# EAGLE design gps_13 (EAGLE 6.1)
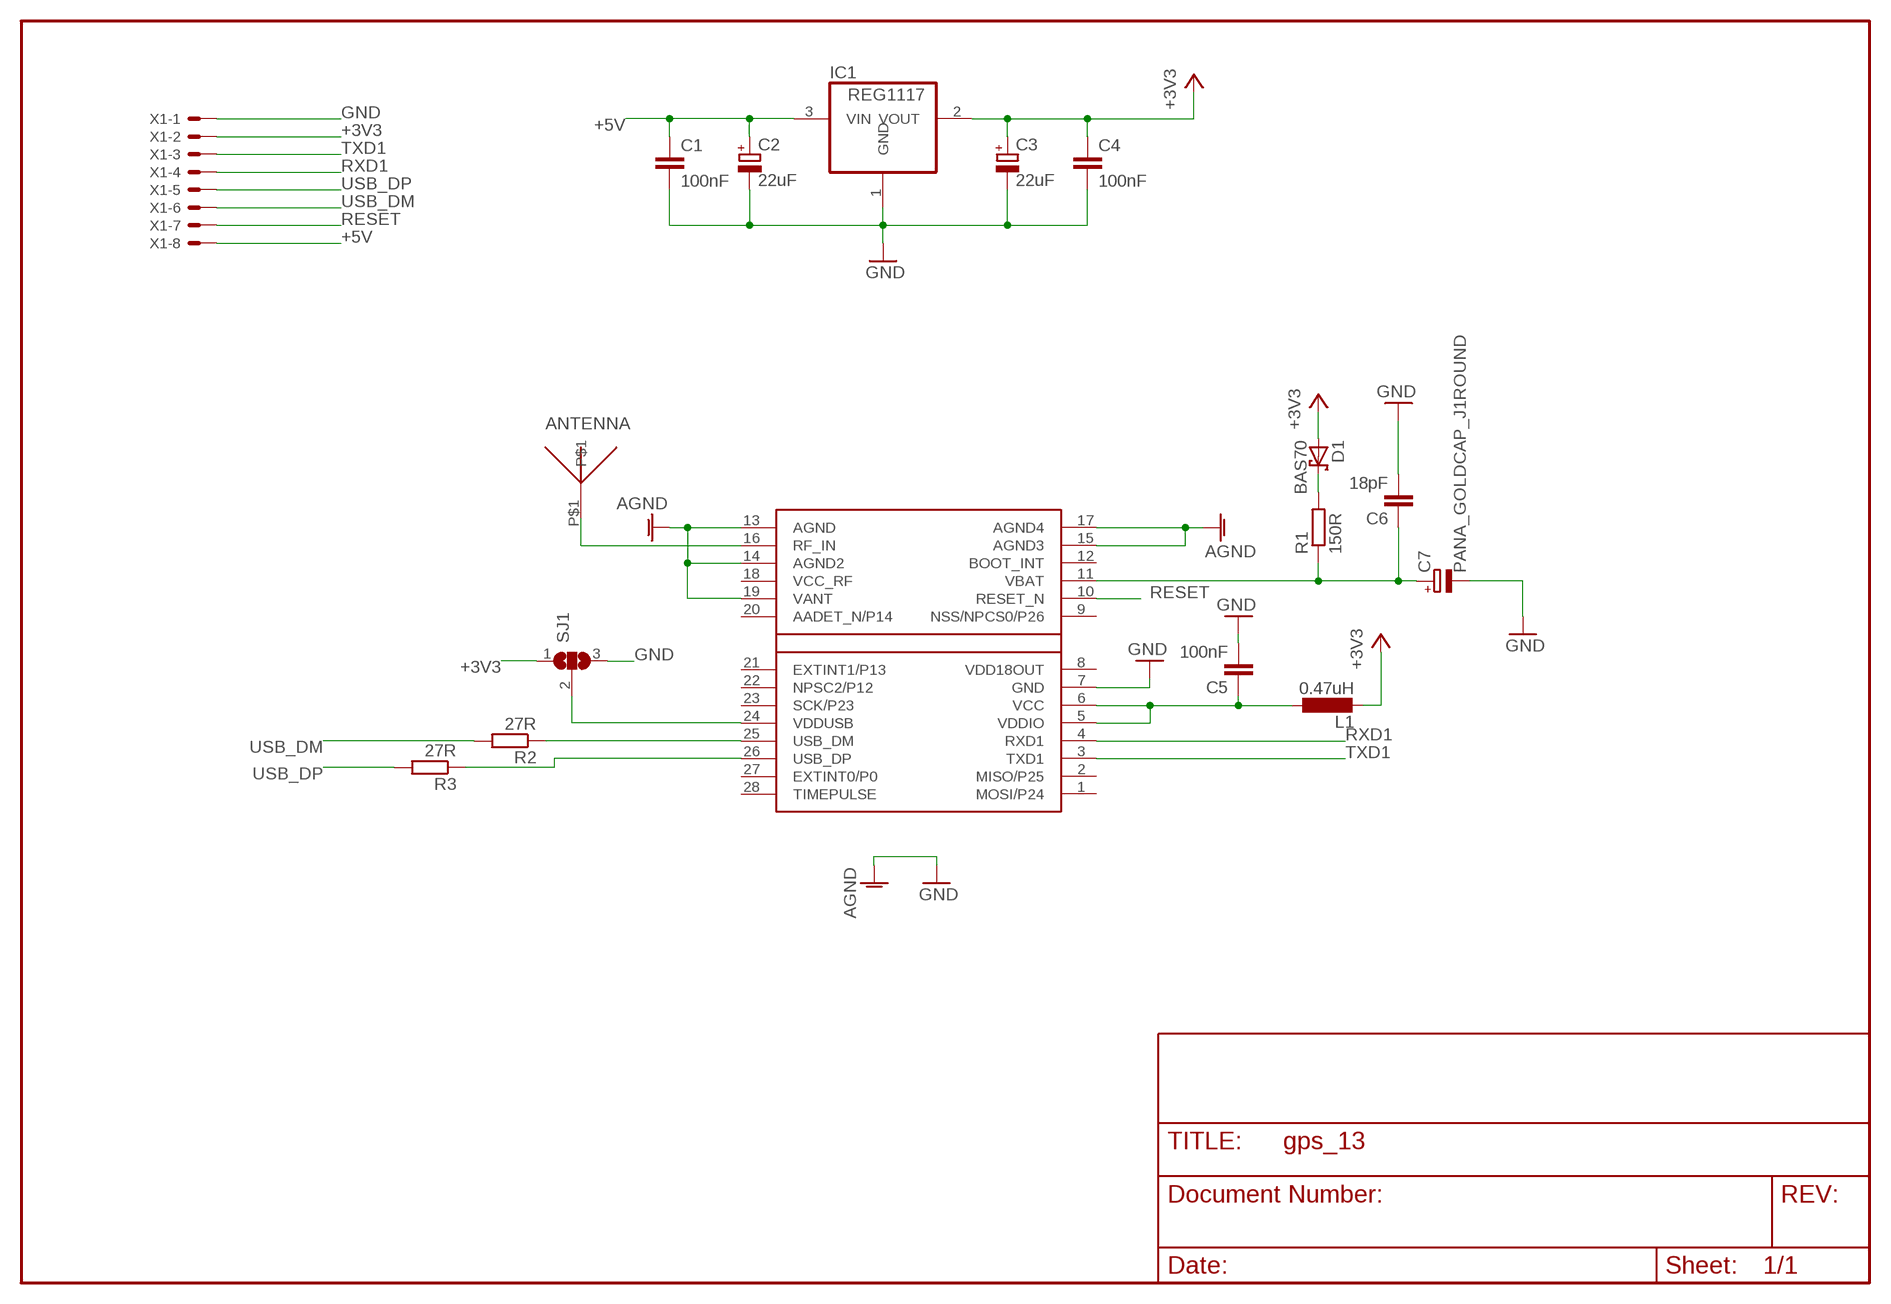
[diagram p0: schematic, sheet 1]

## Parts
ANTENNA  GPS_ANT_13  [GPS_ANT_13]
C1  100nF  C-EUC0603K  [C0603K]
C2  22uF  CPOL-EUB/3528-21R  [B/3528-21R]
C3  22uF  CPOL-EUB/3528-21R  [B/3528-21R]
C4  100nF  C-EUC0603K  [C0603K]
C5  100nF  C-EUC0603K  [C0603K]
C6  18pF  C-EUC0603K  [C0603K]
C7  PANA_GOLDCAP_J1ROUND  [PANA_J1_BIS]
D1  BAS70  [SOT23]
IC1  REG1117  [SOT223]
L1  0.47uH  L-EUL2012C  [L2012C]
R1  150R  R-EU_R1005  [R1005]
R2  27R  R-EU_R1005  [R1005]
R3  27R  R-EU_R1005  [R1005]
SJ1  SJ2W  [SJ_2]
U$6  LEA-4P  [LEA-LA]
X1  53047-08  [53047-08]

## Nets
+3V3: C3.+ C4.1 D1.1(A) IC1.2(VOUT) L1.2 SJ1.1 X1.2
+5V: C1.1 C2.+ IC1.3(VIN) X1.8
GND: C1.2 C2.- C3.- C4.2 C5.2 C6.2 C7.MINUS(-) IC1.1(GND) SJ1.3 U$6.7(GND) U$6.13(AGND) U$6.14(AGND2) U$6.15(AGND3) U$6.17(AGND4) U$6.19(VANT) X1.1 ; supply symbol labelled AGND
N$1: C5.1 L1.1 U$6.5(VDDIO) U$6.6(VCC)
N$3: ANTENNA.P$1 U$6.16(RF_IN)
N$4: R2.1 U$6.25(USB_DM)
N$5: R3.1 U$6.26(USB_DP)
N$8: SJ1.2 U$6.24(VDDUSB)
N$28: C6.1 C7.PLUS(+) R1.1 U$6.11(VBAT)
N$29: D1.3(C) R1.2
RESET: U$6.10(RESET_N) X1.7
RXD1: U$6.4(RXD1) X1.4
TXD1: U$6.3(TXD1) X1.3
USB_DM: R2.2 X1.6
USB_DP: R3.2 X1.5
Unconnected: U$6.1(MOSI/P24) U$6.2(MISO/P25) U$6.9(NSS/NPCS0/P26) U$6.12(BOOT_INT) U$6.20(AADET_N/P14) U$6.21(EXTINT1/P13) U$6.22(NPSC2/P12) U$6.23(SCK/P23) U$6.27(EXTINT0/P0) U$6.28(TIMEPULSE)

## Power pins joined to a net without a drawn wire
VCC_RF: U$6.18(VCC_RF)
VDD18OUT: U$6.8(VDD18OUT)

## Library data of the parts
ANTENNA = paparazzi:GPS_ANT_13: Sangshin KSA-ST1575MS13
C1 C4-C6 = rcl:C-EU: CAPACITOR, European symbol
C2 C3 = rcl:CPOL-EU: POLARIZED CAPACITOR, European symbol
C7 = paparazzi:PANA_GOLDCAP_J1
D1 = diode:BAS70: Silicon Schottky Diodes General-purpose diode for high-speed switching
IC1 = burr-brown:REG1117: 800mA and 1A Low Dropout (LDO) Positive Regulator 1.8V, 2.5V, 2.85V, 3.3V, 5V, and Adj
L1 = rcl:L-EU: INDUCTOR, European symbol
R1-R3 = rcl:R-EU_: RESISTOR, European symbol
SJ1 = jumper:SJ2W: SMD solder JUMPER
U$6 = paparazzi:LEA-4P
X1 = con-molex:53?-08: CONNECTOR wire to board 1.25 mm (.049 inch) pitch header

## Board
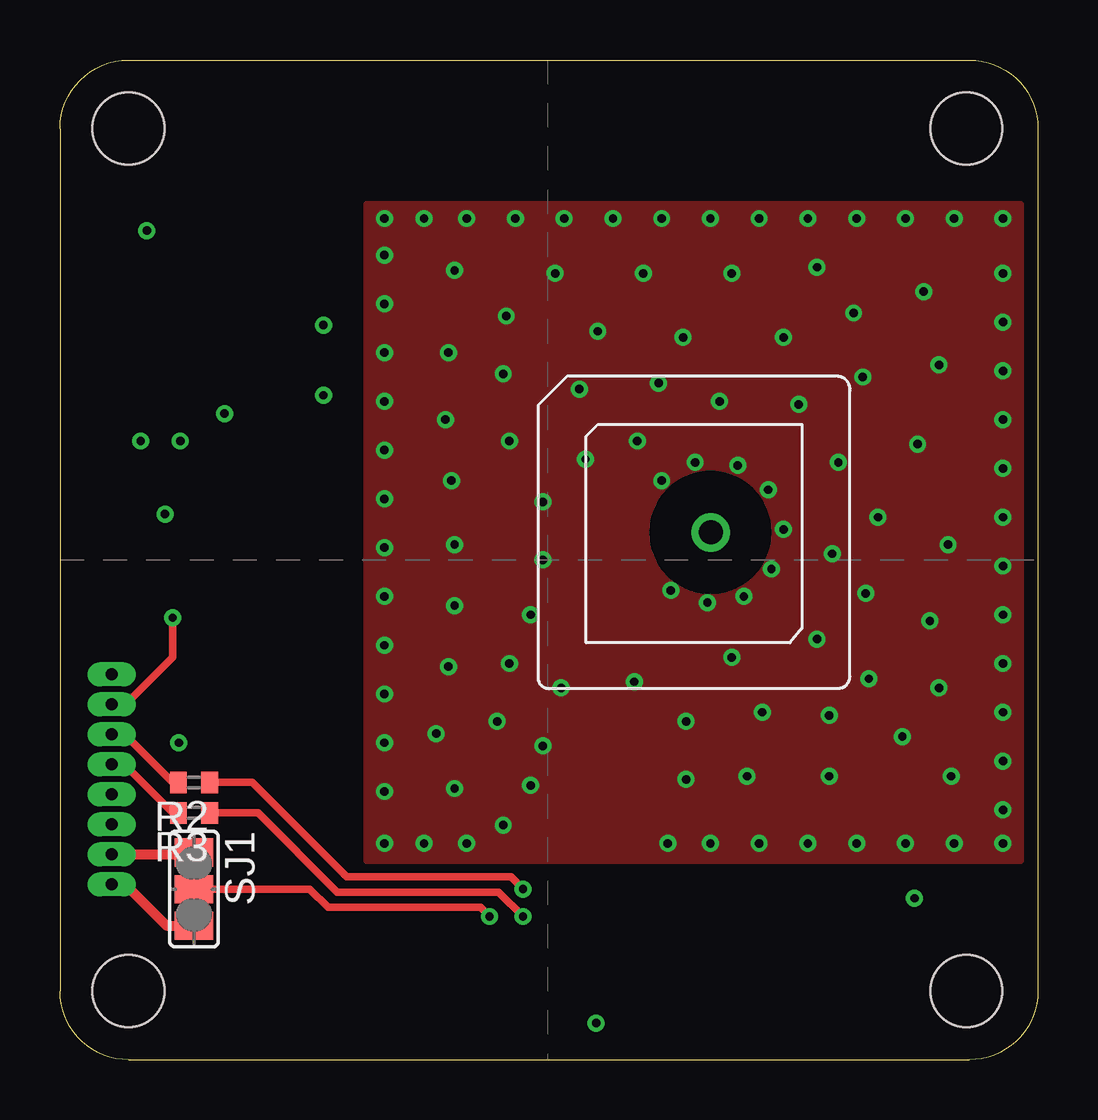
[diagram p1: board, top side]
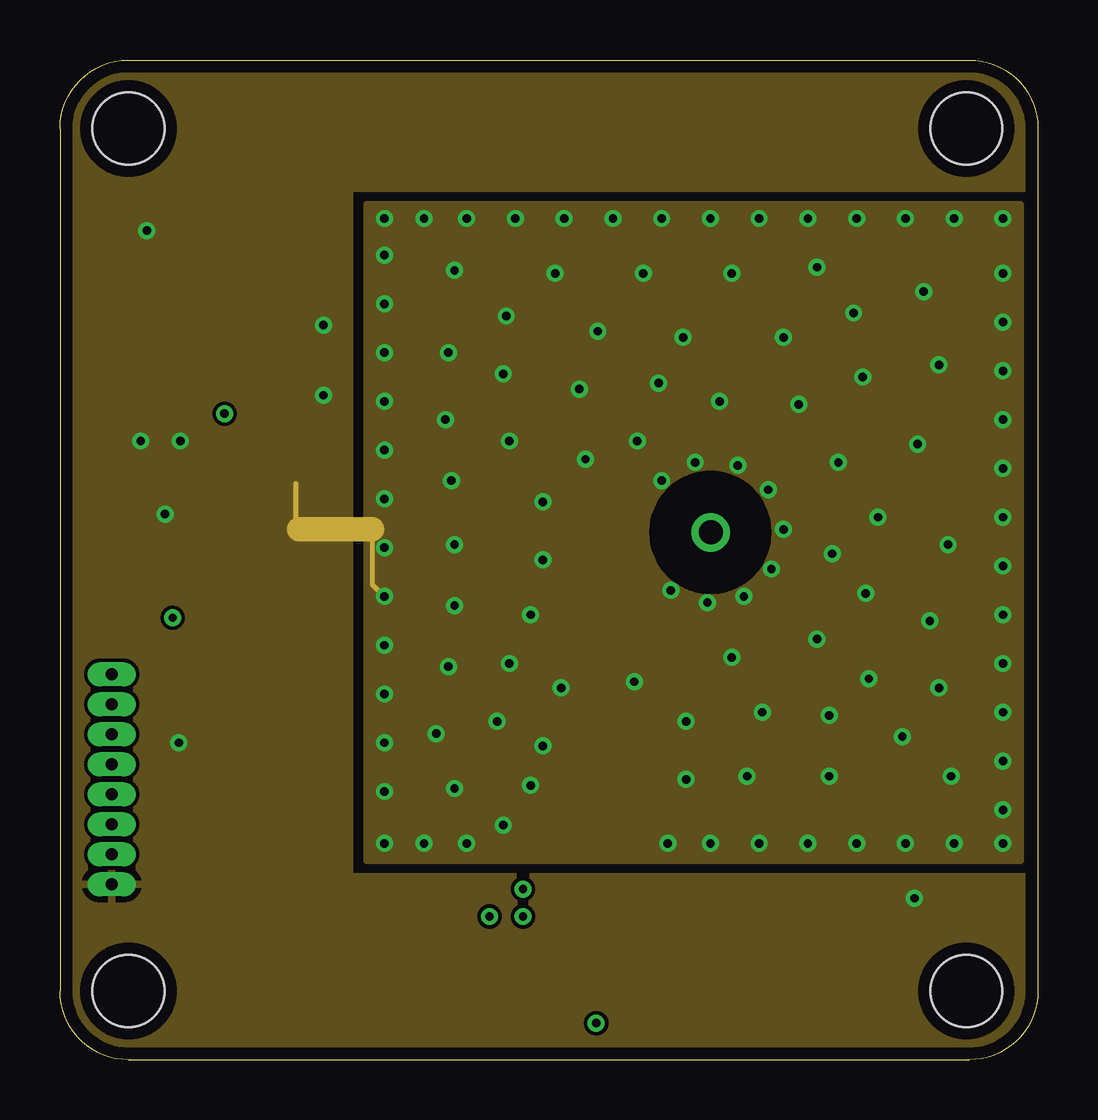
[diagram p2: board, inner layer Route2]
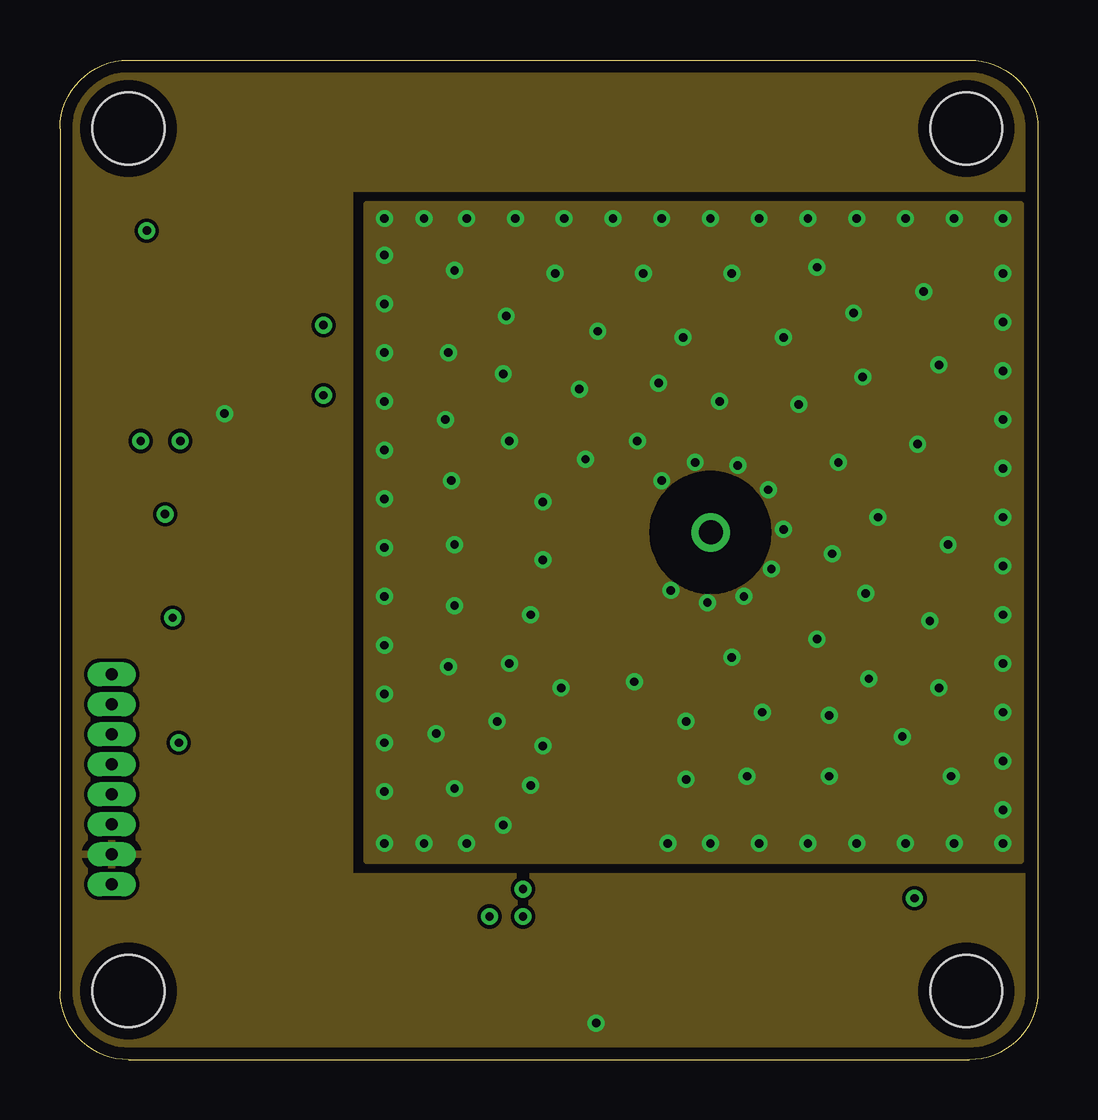
[diagram p3: board, inner layer Route15]
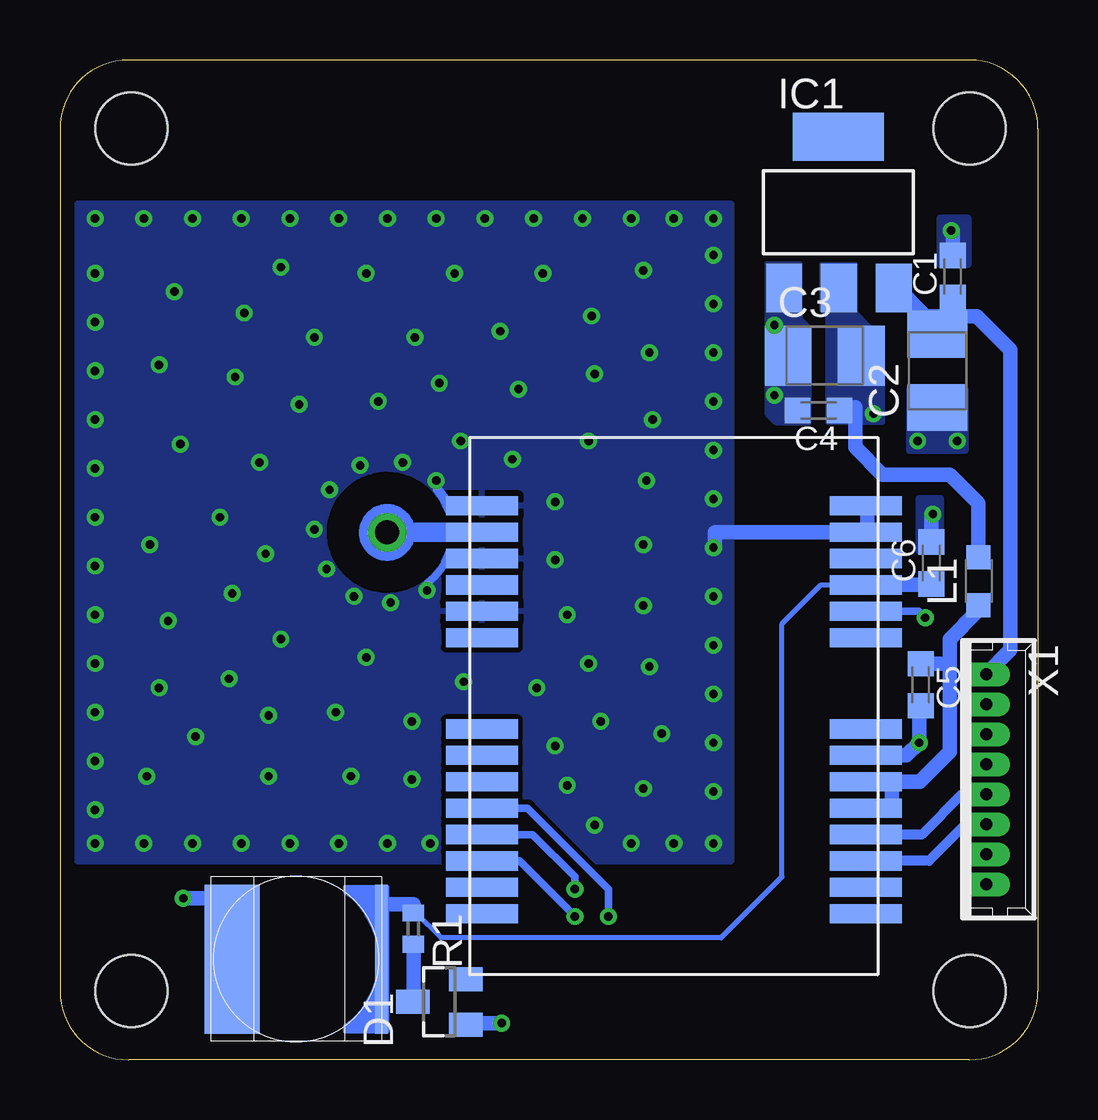
[diagram p4: board, bottom side, seen from below]

Size 40.77 x 41.66 mm. Coordinates in mm from the lower left corner, seen from the top.
Outline: 2.86,41.66 37.91,41.66 arc-90 40.77,38.8 40.77,2.86 arc-90 37.91,0 2.86,0 arc-90 0,2.86 0,38.8 arc-90 2.86,41.66
Copper layers (1*2+15*16): Top 0.035mm / dielectric 0.2mm / Route2 0.035mm / dielectric 1.5mm / Route15 0.035mm / dielectric 0.2mm / Bottom 0.035mm
Design rules: minimum track width 0.15mm, minimum drill 0.35mm, track to track 0.15mm, track to pad 0.15mm, pad to pad 0.15mm, via to via 0.15mm, smd to smd 0.15mm, copper to edge 20mil, drill to drill 8mil, minimum pad ring 10mil, minimum via ring 7mil, stop-mask expansion 4mil, vias tented up to drill 0mil, thermal gap 10mil
Holes 3 mm at 2.86,38.8 37.78,38.8 2.86,2.86 37.78,2.86
tRestrict: area 25.1,20 to 29.1,24; area 25.7,20.6 to 28.5,23.4
bRestrict: 4 lines

### Footprints (pad centres in the part's own frame; a part is rotated, then mirrored left to right if it is on the bottom)
GPS_ANT_13 = drill 1 pad 1.6: P$1 0,-0.7
C0603K = smd 1.05 x 1.08: 1 -0.875,0; 2 0.875,0
B/3528-21R = smd 1.95 x 2.5: + 1.525,0; - -1.525,0
PANA_J1_BIS = smd 6.2 x 2.3: MINUS 0,-2.794 | smd 6.198 x 0.508: PLUS 0,3.429
SOT23 = smd 1 x 1.4: 1 -0.95,-1.1; 2 0.95,-1.1; 3 0,1.1
SOT223 = smd 1.499 x 2.007: 1 -2.261,-3.15; 2 0.025,-3.15; 3 2.311,-3.15 | smd 3.81 x 2.007: 4 0,3.15
L2012C = smd 1 x 1: 1 -1,0; 2 1,0
R1005 = smd 0.7 x 0.9: 1 -0.65,0; 2 0.65,0
SJ_2 = smd 1.168 x 1.6: 1 -1.524,0; 2 0,0; 3 1.524,0
LEA-LA = smd 3 x 0.8: 1 8,-8.65; 2 8,-7.55; 3 8,-6.45; 4 8,-5.35; 5 8,-4.25; 6 8,-3.15; 7 8,-2.05; 8 8,-0.95; 9 8,2.85; 10 8,3.95; 11 8,5.05; 12 8,6.15; 13 8,7.25; 14 8,8.35; 15 -8,8.35; 16 -8,7.25; 17 -8,6.15; 18 -8,5.05; 19 -8,3.95; 20 -8,2.85; 21 -8,-0.95; 22 -8,-2.05; 23 -8,-3.15; 24 -8,-4.25; 25 -8,-5.35; 26 -8,-6.45; 27 -8,-7.55; 28 -8,-8.65
53047-08 = drill 0.5 pad 0.698 long: 1 4.375,0; 2 3.125,0; 3 1.875,0; 4 0.625,0; 5 -0.625,0; 6 -1.875,0; 7 -3.125,0; 8 -4.375,0

### Placement (x,y rotation side)
ANTENNA  26.43,21.97 90 top
C1  3.56,32.64 90 bottom
C2  4.19,28.7 90 bottom
C3  8.89,29.34 0 bottom
C4  9.14,27.05 180 bottom
C5  4.89,15.62 270 bottom
C6  4.45,20.7 90 bottom
C7  30.8,4.19 270 bottom
D1  24.96,2.41 90 bottom
IC1  8.32,35.31 0 bottom
L1  2.48,19.94 90 bottom
R1  26.04,5.46 270 bottom
R2  5.59,11.56 180 top
R3  5.59,10.29 180 top
SJ1  5.59,7.11 270 top
U$6  15.18,14.73 0 bottom
X1  2.16,11.68 270 bottom

### Tracks (layer width: path | path; a pad name or v marks a point on that pad's centre or on a via)
+3V3  (via drill 0.35)
  Top 0.406: SJ1.1 5.59,8.51 5.54,8.56 X1.2
  Bottom 0.61: D1.1 23.88,1.46 23.88,1.52 v22.35,1.52 | L1.2 2.48,23.18 3.68,24.38 6.48,24.38 7.62,25.53 7.62,27.18
  other vias: 6.86,26.92
  pour Route15: 40.51,41.4 0.13,41.4 0.13,0.13 40.51,0.13 40.51,7.62 12.06,7.62 12.06,36.32 40.51,36.32
  pour Bottom (no thermals): 7.62,33.15 7.62,31.11 6.98,30.48 6.48,30.48 6.48,26.54 8.76,26.54 8.76,30.99 9.02,31.24 9.02,33.15
+5V
  Bottom 0.61: X1.8 1.14,17.07 1.14,29.59 2.54,30.99 3.56,30.99 | 3.56,30.99 4.19,30.99 | 4.19,30.99 4.7,30.99 5.87,32.16 IC1.3 | 3.56,30.99 C1.1 | 4.19,30.99 C2.+
GND  (via drill 0.35)
  Top 0.406: X1.1 2.72,7.31 4.45,5.59 SJ1.3
  Route2 0.203: 13.02,22.1 13.02,19.81 v13.53,19.3 | 9.97,22.1 9.84,22.23 9.84,24
  Route2 1.016: 9.97,22.1 13.02,22.1
  Bottom 0.305: 24.56,21.11 arc36 25.45,19.87
  Bottom 0.406: 25.02,23.76 arc21 24.54,22.91
  Bottom 0.61: C7.MINUS 33.59,6.73 v35.62,6.73 | 7.11,21.98 7.11,21.97 | 7.11,21.98 U$6.13 13.46,21.98 13.46,21.34 v13.53,21.34 | U$6.14 7.11,23.08 7.11,21.98 | v4.38,22.73 4.45,22.73 C6.2 | v3.62,34.54 3.56,34.54 C1.2 | U$6.7 5.48,12.68 v4.95,13.21 4.95,14.73 4.94,14.75 C5.2
  other vias: 25.08,24.13 26.48,24.89 28.26,24.77 29.53,23.75 30.16,22.1 25.46,19.56 26.99,19.05 28.51,19.3 29.65,20.45 15.18,35.05 16.95,35.05 18.99,35.05 21.02,35.05 23.05,35.05 25.08,35.05 27.11,35.05 29.15,35.05 31.18,35.05 33.21,35.05 35.24,35.05 37.27,35.05 39.31,35.05 39.31,32.77 39.31,30.73 39.31,28.7 39.31,26.67 39.31,24.64 39.31,22.61 39.31,20.57 39.31,18.54 39.31,16.51 39.31,14.48 39.31,12.45 39.31,10.41 39.31,9.02 37.27,9.02 35.24,9.02 33.21,9.02 31.18,9.02 29.15,9.02 27.11,9.02 25.34,9.02 18.48,9.78 16.95,9.02 15.18,9.02 13.53,9.02 13.53,11.18 13.53,13.21 13.53,15.24 13.53,17.27 13.53,23.37 13.53,25.4 13.53,27.43 13.53,29.46 13.53,31.5 13.53,33.53 13.53,35.05 32.07,11.81 26.1,11.68 26.1,14.1 23.94,15.75 20.89,15.49 20.13,13.08 16.45,11.3 15.68,13.59 18.22,14.1 19.62,18.54 20.13,20.83 20.13,23.24 21.91,25.02 24.07,25.78 28.64,11.81 29.27,14.48 35.12,13.46 36.64,15.49 33.72,15.88 28,16.76 31.56,17.53 33.59,19.43 36.26,18.29 37.02,21.46 34.1,22.61 32.19,21.08 32.45,24.89 35.75,25.65 36.64,28.96 36,32 33.46,28.45 30.8,27.3 27.5,27.43 30.16,30.1 33.08,31.11 28,32.77 25.97,30.1 24.32,32.77 16.45,18.92 16.45,21.46 18.73,25.78 16.32,24.13 37.15,11.81 31.56,33.02 16.07,26.67 18.48,28.57 21.65,27.94 24.96,28.19 22.42,30.35 18.61,30.99 20.64,32.77 32.07,14.35 16.19,16.38 3.37,25.78 5.02,25.78 10.99,27.69 10.99,30.61 16.45,32.89 16.19,29.46 19.62,11.43 18.73,16.51
  pour Bottom (isolate 0.203): 12.76,35.69 40.07,35.69 40.07,8.26 12.76,8.26
  pour Route15 (isolate 0.203, no thermals): 12.76,35.69 27.11,35.69 27.11,24.64 arc180 27.11,19.3 27.11,8.26 12.76,8.26
  pour Route15: 27.11,35.69 40.07,35.69 40.07,8.26 27.11,8.26 27.11,19.3 arc180 27.11,24.64
  pour Route2 (isolate 0.203): 12.76,35.69 27.11,35.69 27.11,24.64 arc180 27.11,19.3 27.11,8.26 12.76,8.26
  pour Route2 (isolate 0.203): 27.11,35.69 40.07,35.69 40.07,8.26 27.11,8.26 27.11,19.3 arc180 27.11,24.64
  pour Top (isolate 0.203): 12.76,35.69 27.11,35.69 27.11,24.64 arc180 27.11,19.3 27.11,8.26 12.76,8.26
  pour Top (isolate 0.203): 27.11,35.69 40.07,35.69 40.07,8.26 27.11,8.26 27.11,19.3 arc180 27.11,24.64
  pour Route2: 40.51,7.62 40.51,0.13 0.13,0.13 0.13,41.4 40.51,41.4 40.51,36.32 12.06,36.32 12.06,7.62
  pour Bottom (no thermals): 3.05,27.94 5.33,27.94 5.33,25.4 3.05,25.4
  pour Bottom (no thermals): 4.95,21.21 4.95,23.37 4.06,23.37 4.06,21.21
  pour Bottom (no thermals): 2.92,33.15 2.92,35.05 4.06,35.05 4.06,33.15
  pour Bottom (no thermals): 9.53,30.48 9.91,30.86 9.91,33.15 11.3,33.15 11.3,26.92 10.92,26.54 9.53,26.54
N$1
  Bottom 0.61: 6.1,11.58 U$6.6 | 6.1,11.58 6.1,10.54 7.11,10.54 7.11,10.48 U$6.5 | 6.1,11.58 4.93,11.58 3.68,12.83 3.68,16.51 | 2.52,18.94 L1.1 2.49,18.92 2.54,18.92 2.54,18.67 3.68,17.53 3.68,16.51 | C5.1 3.7,16.5 3.68,16.51
N$2
  Bottom 0.406: 27.19,21.03 27.19,21.01
N$3
  Bottom 0.813: ANTENNA.P$1 27.11,21.97 27.1,21.98 U$6.16
N$4  (via drill 0.35)
  Top 0.305: v19.3,7.11 18.8,7.62 11.94,7.62 8,11.56 R2.1
  Bottom 0.305: U$6.25 21.07,9.38 19.3,7.62 v19.3,7.11
N$5  (via drill 0.35)
  Top 0.305: v19.3,5.97 18.29,6.99 11.56,6.99 8.26,10.29 R3.1 6.22,10.29
  Bottom 0.305: U$6.26 21.62,8.28 v19.3,5.97
N$8  (via drill 0.35)
  Top 0.305: SJ1.2 10.41,7.11 11.18,6.35 17.53,6.35 v17.91,5.97
  Bottom 0.305: v17.91,5.97 17.91,7.11 21.28,10.48 U$6.24
N$28
  Bottom 0.203: U$6.11 9.05,19.78 10.67,18.16 10.67,7.62 13.21,5.08 24.89,5.08 25.92,6.11 R1.1 | C7.PLUS 27.3,4.19 27.3,6.48
  Bottom 0.61: 27.3,6.49 27.3,6.48 26.04,6.48 R1.1 | U$6.11 4.45,19.78 C6.1
N$29
  Bottom 0.61: 26.04,4.83 R1.2 26.04,2.41 D1.3
RESET  (via drill 0.35)
  Top 0.305: v4.7,18.41 4.7,16.76 2.74,14.81 X1.7
  Bottom 0.305: U$6.10 4.97,18.68 v4.7,18.41
RXD1
  Bottom 0.406: X1.4 3.17,11.06 4.84,9.38 U$6.4
TXD1
  Bottom 0.406: U$6.3 4.54,8.28 3.02,9.81 X1.3
USB_DM
  Top 0.305: X1.6 2.7,13.56 4.7,11.56 R2.2
USB_DP
  Top 0.305: X1.5 2.68,12.31 4.7,10.29 R3.2

### Text on the board
tDocu: Paparazzi GPS13 V0.90 | by Martin & Poine